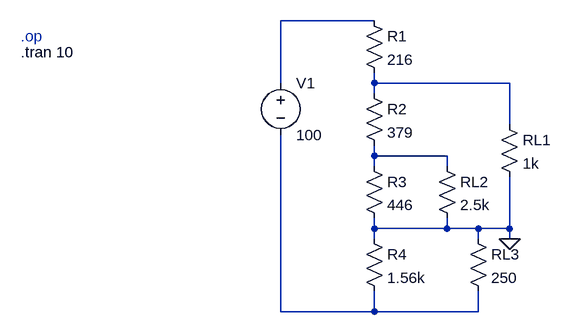
[diagram p0: schematic circuit.asc]
circuit.asc, the LTspice schematic file:
Version 4.1
SHEET 1 880 680
WIRE 176 48 32 48
WIRE 32 144 32 48
WIRE 176 144 176 128
WIRE 384 144 176 144
WIRE 176 160 176 144
WIRE 384 208 384 144
WIRE 176 256 176 240
WIRE 288 256 176 256
WIRE 176 272 176 256
WIRE 288 272 288 256
WIRE 176 368 176 352
WIRE 288 368 288 352
WIRE 288 368 176 368
WIRE 336 368 288 368
WIRE 384 368 384 288
WIRE 384 368 336 368
WIRE 176 384 176 368
WIRE 336 384 336 368
WIRE 384 384 384 368
WIRE 32 496 32 224
WIRE 176 496 176 464
WIRE 176 496 32 496
WIRE 336 496 336 464
WIRE 336 496 176 496
FLAG 384 384 0
DATAFLAG 176 48 "round($)"
DATAFLAG 176 144 "round($)"
DATAFLAG 176 256 "round($)"
DATAFLAG 176 368 ""
DATAFLAG 176 496 "round($)"
DATAFLAG 384 144 "round($)"
DATAFLAG 48 48 "round(-I(V1)*1k)/1k"
DATAFLAG 384 192 "round(I(RL1)*1k)/1k"
DATAFLAG 288 288 "round(I(RL2)*1k)/1k"
DATAFLAG 384 480 "round(I(RL3)*1k)/1k"
SYMBOL voltage 32 128 R0
WINDOW 123 0 0 Left 0
WINDOW 39 0 0 Left 0
SYMATTR InstName V1
SYMATTR Value 100
SYMBOL res 160 32 R0
SYMATTR InstName R1
SYMATTR Value 216
SYMBOL res 160 144 R0
SYMATTR InstName R2
SYMATTR Value 379
SYMBOL res 160 256 R0
SYMATTR InstName R3
SYMATTR Value 446
SYMBOL res 160 368 R0
SYMATTR InstName R4
SYMATTR Value 1.56k
SYMBOL res 368 192 R0
SYMATTR InstName RL1
SYMATTR Value 1k
SYMBOL res 272 256 R0
SYMATTR InstName RL2
SYMATTR Value 2.5k
SYMBOL res 320 368 R0
SYMATTR InstName RL3
SYMATTR Value 250
TEXT -368 72 Left 2 ;.op
TEXT -368 96 Left 2 !.tran 10

The netlist it stands for:
* circuit.asc
V1 N001 N004 100
R1 N001 N002 216
R2 N002 N003 379
R3 N003 0 446
R4 0 N004 1.56k
RL1 N002 0 1k
RL2 N003 0 2.5k
RL3 0 N004 250
* .op
.tran 10
.backanno
.end